# EAGLE design PayloadSheildV5 (EAGLE 6.2)
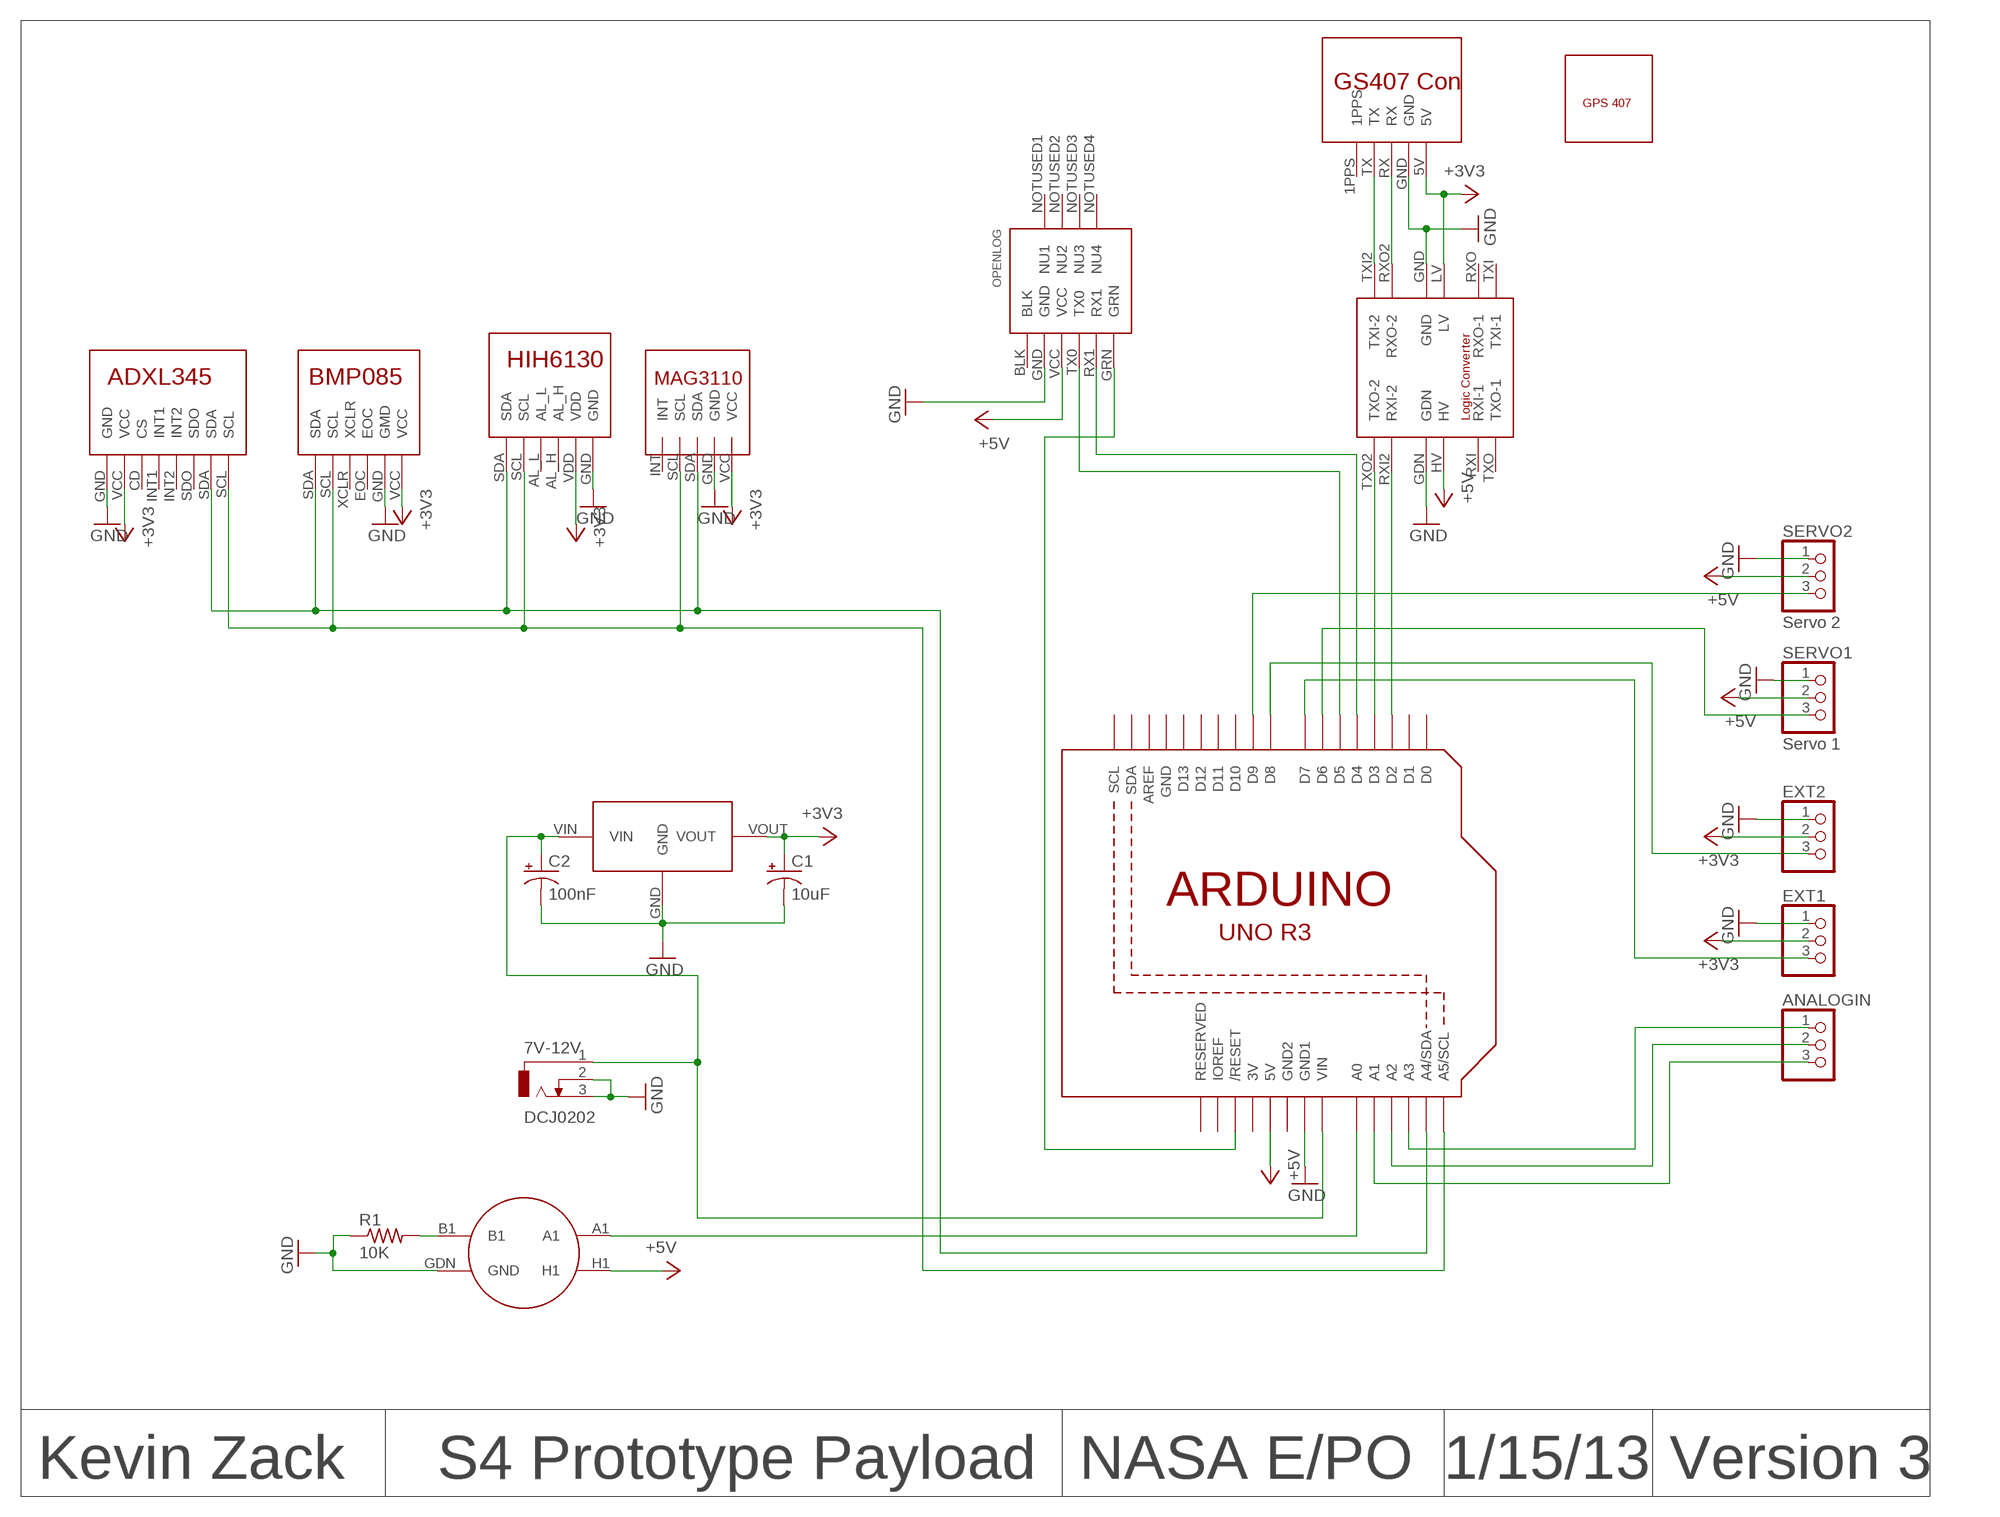
[diagram p0: schematic, sheet 1]

## Parts
3.3V  LD1117V33  [LD1117V33]
7V-12V  DCJ0202  [DCJ0202]
ADXL345  ADXL345  [ADXL345+]
ANALOGIN  PINHD-1X3  [1X03]
BMP085  BMP085  [BMP085]
C1  10uF  CPOL-USE2.5-6  [E2,5-6]
C2  100nF  CPOL-USE2.5-6  [E2,5-6]
EXT1  PINHD-1X3  [1X03]
EXT2  PINHD-1X3  [1X03]
GASSEN  GAS  [GAS]
GPS  GPS  [GPS]
GPSCON  EM407CONNECTOR  [EM407CONNECTOR]
HIH6310  HIH6130  [HIH6130]
LOGIC  LOGICCONVERTER  [LOGICCONVERTER]
MAG3110  MAG3110  [MAG3110]
OPENLOG  OPENLOG  [OPENLOG]
R1  10K  R-US_0204/5  [0204/5]
SERVO1  Servo 1  PINHD-1X3  [1X03]
SERVO2  Servo 2  PINHD-1X3  [1X03]
U2  ARDUINOR3  [ARDUINOR3]

## Nets
+3V3: 3.3V.VOUT ADXL345.VCC BMP085.VCC C1.+ EXT1.2 EXT2.2 GPSCON.5V HIH6310.VDD LOGIC.LV MAG3110.VCC
+5V: GASSEN.H1 LOGIC.HV OPENLOG.VCC SERVO1.2 SERVO2.2 U2.5V
GND: 3.3V.GND 7V-12V.2 7V-12V.3 ADXL345.GND BMP085.GND(GMD) C1.- C2.- EXT1.1 EXT2.1 GASSEN.GDN(GND) GPSCON.GND HIH6310.GND LOGIC.GDN LOGIC.GND MAG3110.GND OPENLOG.GND R1.1 SERVO1.1 SERVO2.1 U2.GND1
N$1: GASSEN.A1 U2.A0
N$2: GPSCON.RX LOGIC.RXO2(RXO-2)
N$3: OPENLOG.GRN U2.RESET(/RESET)
N$4: GASSEN.B1 R1.2
N$5: OPENLOG.RX1 U2.D4
N$6: OPENLOG.TX0 U2.D5
N$7: SERVO2.3 U2.D9
N$10: ANALOGIN.1 U2.A3
N$11: SERVO1.3 U2.D6
N$12: ANALOGIN.2 U2.A2
N$27: ANALOGIN.3 U2.A1
N$28: 3.3V.VIN 7V-12V.1 C2.+ U2.VIN
N$32: GPSCON.TX LOGIC.TXI2(TXI-2)
N$35: LOGIC.RXI2(RXI-2) U2.D2
N$36: EXT1.3 U2.D7
N$40: EXT2.3 U2.D8
N$41: LOGIC.TXO2(TXO-2) U2.D3
SCL: ADXL345.SCL BMP085.SCL HIH6310.SCL MAG3110.SCL U2.A5(A5/SCL)
SDA: ADXL345.SDA BMP085.SDA HIH6310.SDA MAG3110.SDA U2.A4(A4/SDA)
Unconnected: ADXL345.CD(CS) ADXL345.INT1 ADXL345.INT2 ADXL345.SDO BMP085.EOC BMP085.XCLR GPSCON.1PPS HIH6310.AL_H HIH6310.AL_L LOGIC.RXI(RXI-1) LOGIC.RXO(RXO-1) LOGIC.TXI(TXI-1) LOGIC.TXO(TXO-1) MAG3110.INT OPENLOG.BLK OPENLOG.NOTUSED1(NU1) OPENLOG.NOTUSED2(NU2) OPENLOG.NOTUSED3(NU3) OPENLOG.NOTUSED4(NU4) U2.AREF U2.D0 U2.D1 U2.D10 U2.D11 U2.D12 U2.D13 U2.IOREF U2.RESERVED U2.SCL U2.SDA

## Notes on the sheet
- Kevin Zack | S4 Prototype Payload | NASA E/PO | 1/15/13 | Version 3

## Power pins joined to a net without a drawn wire
3V: U2.3V
GND: U2.GND
GND2: U2.GND2

## Library data of the parts
3.3V = NASAEPO:LD1117V33
7V-12V = con-jack:DCJ0202: DC POWER JACK Source: DCJ0202.pdf; OC_FARNELL: unknown; OC_NEWARK: unknown
ADXL345 = NASAEPO:ADXL345
ANALOGIN EXT1 EXT2 SERVO1 SERVO2 = adafruit:PINHD-1X3: PIN HEADER
BMP085 = NASAEPO:BMP085
C1 C2 = rcl:CPOL-US: POLARIZED CAPACITOR, American symbol
GASSEN = NASAEPO:GAS
GPS = NASAEPO:GPS
GPSCON = NASAEPO:EM407CONNECTOR
HIH6310 = NASAEPO:HIH6130
LOGIC = NASAEPO:LOGICCONVERTER
MAG3110 = NASAEPO:MAG3110
OPENLOG = NASAEPO:OPENLOG
R1 = rcl:R-US_: RESISTOR, American symbol
U2 = NASAEPO:ARDUINOR3: This is a new object for the new Arduino R3 - with extra pins that you may want to use (such as IOref, and duplicated A4/A5

## Board
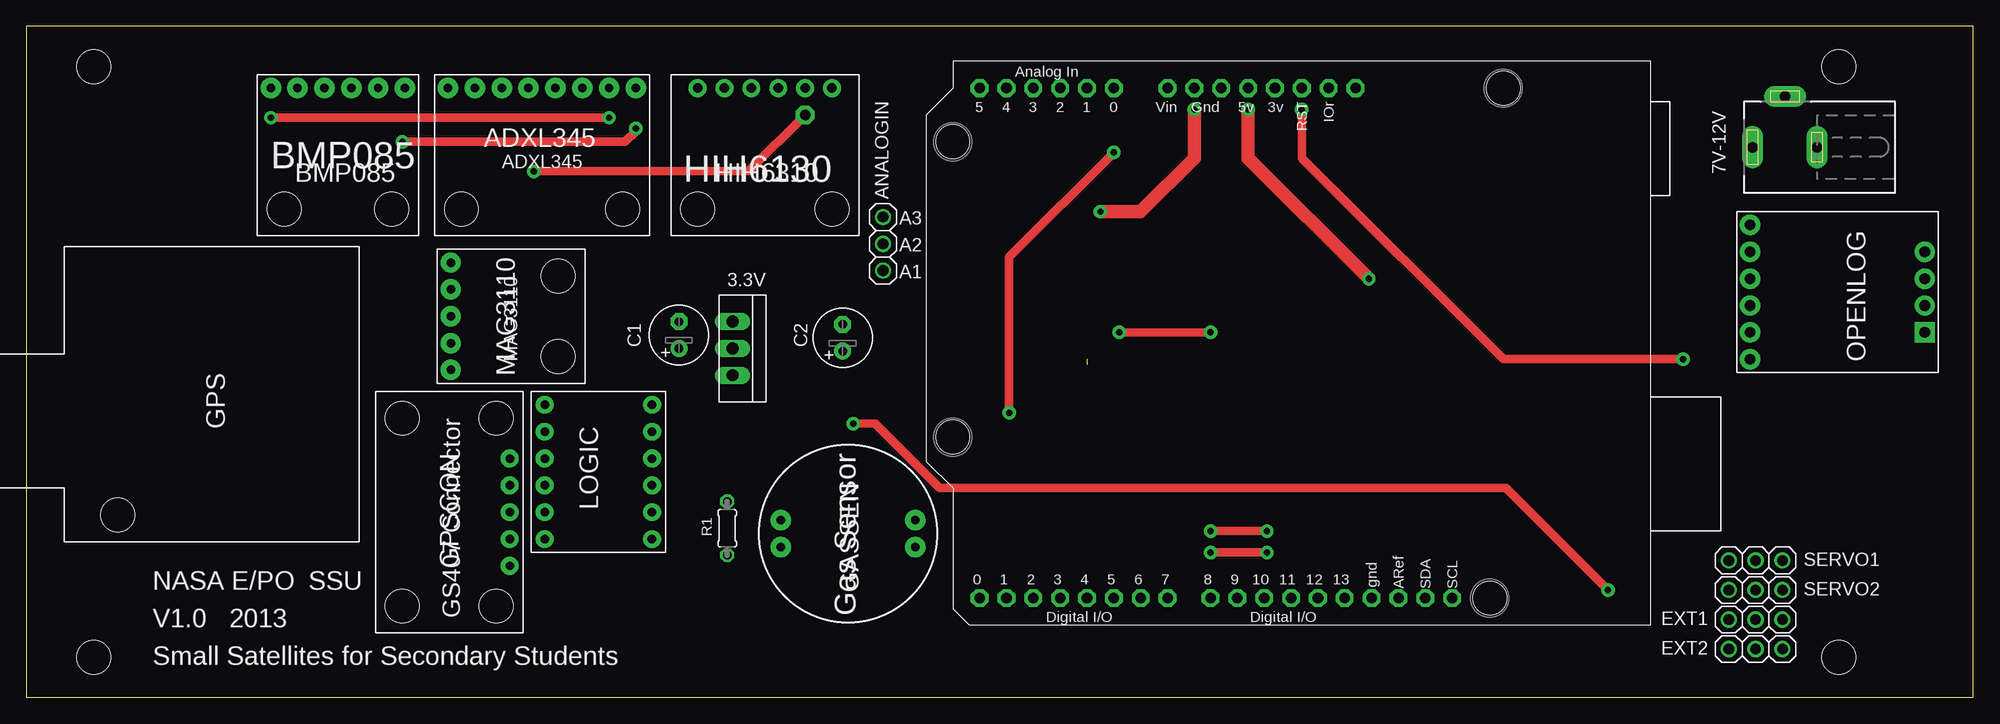
[diagram p1: board, top side]
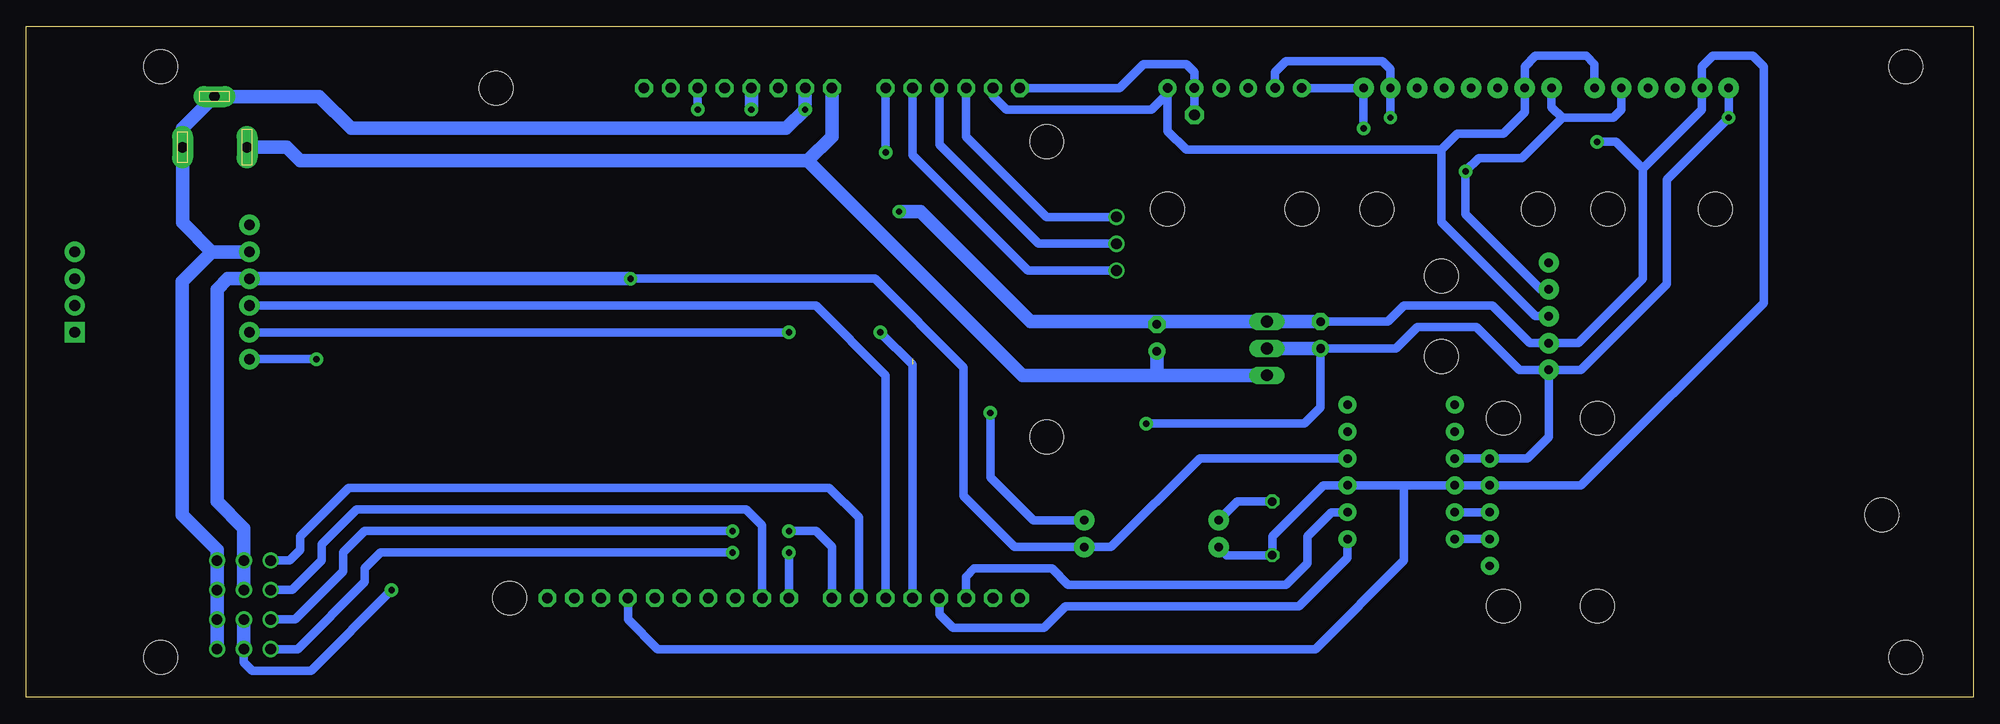
[diagram p2: board, bottom side, seen from below]

Size 184.15 x 63.5 mm. Coordinates in mm from the lower left corner, seen from the top.
Outline: 0,0 184.15,0 184.15,63.5 0,63.5 0,0
Copper layers (1*16): Top 0.035559375mm / dielectric 1.501140625mm / Bottom 0.035559375mm
Design rules: minimum track width 10mil, minimum drill 15mil, track to track 6mil, track to pad 6mil, pad to pad 6mil, via to via 6mil, smd to smd 6mil, copper to edge 15mil, drill to drill 8mil, minimum pad ring 10mil, minimum via ring 8mil, stop-mask expansion 4mil, vias tented up to drill 0mil, thermal gap 10mil
Holes 3.2 mm at 6.35,3.81 6.35,59.69 171.45,59.69 171.45,3.81

### Footprints (pad centres in the part's own frame; a part is rotated, then mirrored left to right if it is on the bottom)
LD1117V33 = drill 1.118 long: GND 2.54,1.27; VIN 7.62,1.27; VOUT 5.08,1.27
DCJ0202 = drill 1 pad 2 long: 1 0,3.1; 2 4.8,0; 3 0,-3
ADXL345+ = drill 0.8 pad 1.93: CD 6.35,1.27; GND 1.27,1.27; INT1 8.89,1.27; INT2 11.43,1.27; SCL 19.05,1.27; SDA 16.51,1.27; SDO 13.97,1.27; VCC 3.81,1.27 | hole 3.2: 2.54,12.7; 17.78,12.7
1X03 = drill 1.016: 1 -2.54,0; 2 0,0; 3 2.54,0
BMP085 = drill 0.8 pad 1.93: EOC 6.35,13.97; GND 3.81,13.97; SCL 11.43,13.97; SDA 13.97,13.97; VCC 1.27,13.97; XCLR 8.89,13.97 | hole 3.2: 2.54,2.54; 12.7,2.54
E2,5-6 = drill 0.813 pad 1.6: + -1.27,0 | drill 0.813 pad 1.6 octagon: - 1.27,0
GAS = drill 0.8 pad 1.93: A1 7.62,15.24; B1 7.62,2.54; GDN 10.16,2.54; H1 10.16,15.24
GPS = hole 3.2: 2.54,22.86
EM407CONNECTOR = drill 0.8 pad 1.676: 1PPS 16.51,12.7; 5V 6.35,12.7; GND 8.89,12.7; RX 11.43,12.7; TX 13.97,12.7 | hole 3.2: 2.54,11.43; 20.32,11.43; 20.32,2.54; 2.54,2.54
HIH6130 = drill 0.9 pad 1.676: AL_H 10.16,1.27; AL_L 7.62,1.27; GND 15.24,1.27; SCL 5.08,1.27; SDA 2.54,1.27; VDD 12.7,1.27 | hole 3.2: 2.54,12.7; 15.24,12.7
LOGICCONVERTER = drill 0.8 pad 1.676: GDN 11.43,6.35; GND 1.27,6.35; HV 11.43,8.89; LV 1.27,8.89; RXI 11.43,11.43; RXI2 11.43,3.81; RXO 1.27,11.43; RXO2 1.27,3.81; TXI 1.27,13.97; TXI2 1.27,1.27; TXO 11.43,13.97; TXO2 11.43,1.27
MAG3110 = drill 0.8 pad 1.93: GND 8.89,1.27; INT 1.27,1.27; SCL 3.81,1.27; SDA 6.35,1.27; VCC 11.43,1.27 | hole 3.2: 2.54,11.43; 10.16,11.43
OPENLOG = drill 1 pad 1.93: BLK 17.78,1.27; GND 17.78,3.81; GRN 17.78,13.97; NOTUSED2 1.27,8.89; NOTUSED3 1.27,6.35; NOTUSED4 1.27,3.81; RX1 17.78,11.43; TX0 17.78,8.89; VCC 17.78,6.35 | drill 1 pad 1.93 square: NOTUSED1 1.27,11.43
0204/5 = drill 0.813 octagon: 1 -2.54,0; 2 2.54,0
ARDUINOR3 = drill 1 pad 1.676 octagon: 3V 35.56,2.54; 5V 38.1,2.54; A0 50.8,2.54; A1 53.34,2.54; A2 55.88,2.54; A3 58.42,2.54; A4 60.96,2.54; A5 63.5,2.54; AREF 23.876,50.8; D0 63.5,50.8; D1 60.96,50.8; D2 58.42,50.8; D3 55.88,50.8; D4 53.34,50.8; D5 50.8,50.8; D6 48.26,50.8; D7 45.72,50.8; D8 41.656,50.8; D9 39.116,50.8; D10 36.576,50.8; D11 34.036,50.8; D12 31.496,50.8; D13 28.956,50.8; GND 26.416,50.8; GND1 43.18,2.54; GND2 40.64,2.54; IOREF 30.48,2.54; RESERVED 27.94,2.54; RESET 33.02,2.54; SCL 18.796,50.8; SDA 21.336,50.8; VIN 45.72,2.54 | hole 3.2: 13.97,2.54; 66.04,7.62; 15.24,50.8; 66.04,35.56

### Placement (x,y rotation side)
3.3V  65.53,38.1 270 top
7V-12V  166.37,52.07 90 top
ADXL345  58.93,58.93 180 top
ANALOGIN  81.03,42.93 270 top
BMP085  21.84,43.69 0 top
C1  61.72,34.29 90 top
C2  77.22,34.04 90 top
EXT1  163.58,7.37 180 top
EXT2  163.58,4.57 180 top
GASSEN  68.83,24.38 270 top
GPS  31.5,14.73 90 top
GPSCON  33.02,28.96 270 top
HIH6310  78.74,58.93 180 top
LOGIC  47.75,13.72 0 top
MAG3110  38.86,42.42 270 top
OPENLOG  180.85,45.97 180 top
R1  66.29,16 90 top
SERVO1  163.58,12.95 180 top
SERVO2  163.58,10.16 180 top
U2  153.67,60.2 180 top

### Tracks (layer width: path | path; a pad name or v marks a point on that pad's centre or on a via)
+3V3  (via drill 0.6 pad 1.27)
  Top 0.813: v149.61,10.16 139.95,19.81 86.36,19.81 80.26,25.91 v78.23,25.91 | v55.12,54.86 v23.11,54.86
  Bottom 0.813: EXT2.2 163.58,3.3 162.81,2.54 157.23,2.54 v149.61,10.16 | v78.23,25.91 63.25,25.91 61.72,27.43 C1.+ 54.61,33.02 52.58,35.05 46.99,35.05 42.93,30.99 MAG3110.VCC | HIH6310.VDD 66.04,59.18 65.02,60.2 55.88,60.2 55.12,59.44 ADXL345.VCC v55.12,54.86 | MAG3110.VCC 37.08,30.99 28.96,39.12 28.96,49.02 v23.11,54.86 BMP085.VCC | LOGIC.LV GPSCON.5V 42.16,22.61 40.13,24.64 MAG3110.VCC
  Bottom 1.27: EXT1.2 EXT2.2 | 3.3V.VOUT C1.+
+5V  (via drill 0.6 pad 1.27)
  Top 1.27: v115.57,55.63 115.57,51.05 v127,39.62
  Bottom 0.813: v127,39.62 103.89,39.62 95.5,31.24 95.5,19.05 90.68,14.22 GASSEN.H1 81.53,14.22 73.15,22.61 LOGIC.HV
  Bottom 1.27: U2.5V v115.57,55.63 | v127,39.62 OPENLOG.VCC 165.1,39.62 166.12,38.61 166.12,18.54 163.58,16 SERVO1.2 SERVO2.2
GND  (via drill 0.6 pad 1.27)
  Top 0.813: v57.66,53.85 57.66,53.59 56.64,52.58 v35.56,52.58
  Top 1.27: v110.49,55.63 110.49,51.05 105.41,45.97 v101.6,45.97
  Bottom 0.813: GASSEN.GDN 70.61,13.46 R1.1 66.29,15.24 61.47,20.07 LOGIC.GDN 53.85,20.07 | HIH6310.GND ADXL345.GND v57.66,53.85 | 31.24,50.04 25.65,55.63 BMP085.GND 25.65,59.69 24.64,60.71 20.83,60.71 19.81,59.69 19.81,37.34 37.08,20.07 GPSCON.GND LOGIC.GND 53.85,20.07 | 31.24,50.04 31.24,39.62 37.34,33.53 MAG3110.GND 41.91,33.53 45.47,37.08 53.85,37.08 55.37,35.56 C1.- | U2.GND 127.25,7.37 124.46,4.57 62.23,4.57 53.85,12.95 53.85,20.07 | v35.56,52.58 33.78,52.58 31.24,50.04
  Bottom 1.27: U2.GND1 v110.49,55.63 112.27,53.85 153.42,53.85 156.44,56.87 7V-12V.2 169.37,53.87 7V-12V.3 169.37,44.91 166.62,42.16 | 166.62,42.16 OPENLOG.GND | 166.62,42.16 169.42,39.37 169.42,17.27 166.12,13.97 SERVO1.1 SERVO2.1 EXT1.1 EXT2.1 | 77.47,35.56 89.15,35.56 99.57,45.97 v101.6,45.97 | 77.47,35.56 3.3V.GND C1.- | C2.- 77.47,35.56
N$1  (via drill 0.6 pad 1.27)
  Top 0.813: v102.87,51.56 92.96,41.66 v92.96,26.92
  Bottom 0.813: GASSEN.A1 88.9,16.76 92.96,20.83 v92.96,26.92 | U2.A0 v102.87,51.56
N$2
  Bottom 0.813: GPSCON.RX LOGIC.RXO2
N$3  (via drill 0.6 pad 1.27)
  Top 0.813: v120.65,55.63 120.65,51.05 139.7,32 v156.72,32
  Bottom 0.813: U2.RESET v120.65,55.63 | v156.72,32 OPENLOG.GRN
N$4
  Bottom 0.813: GASSEN.B1 69.6,18.54 R1.2
N$5  (via drill 0.6 pad 1.27)  (1 unrouted)
  Top 0.813: v112.01,34.54 v103.38,34.54
  Bottom 0.813: OPENLOG.RX1 v112.01,34.54 | U2.D4 100.33,31.5 v103.38,34.54
N$6
  Bottom 0.813: OPENLOG.TX0 109.47,37.08 102.87,30.48 U2.D5
N$7
  Bottom 0.813: SERVO2.3 159,10.16 156.21,12.95 156.21,14.48 152.91,17.78 116.08,17.78 114.55,16.26 U2.D9
N$10
  Bottom 0.813: U2.A3 95.25,53.09 87.63,45.47 ANALOGIN.1
N$11
  Bottom 0.813: U2.D6 105.41,17.02 108.2,19.81 153.67,19.81 158.24,15.24 158.24,13.97 159.26,12.95 SERVO1.3
N$12
  Bottom 0.813: ANALOGIN.2 88.39,42.93 97.79,52.32 U2.A2
N$27
  Bottom 0.813: ANALOGIN.3 89.41,40.39 100.33,51.31 U2.A1
N$28
  Bottom 1.27: U2.VIN 107.95,53.09 110.24,50.8 | 110.24,50.8 158.24,50.8 159.51,52.07 7V-12V.1 | 3.3V.VIN 77.22,30.48 | 77.22,30.48 89.92,30.48 110.24,50.8 | C2.+ 77.22,30.48
N$32
  Bottom 0.813: GPSCON.TX LOGIC.TXI2
N$35
  Bottom 0.813: U2.D2 95.25,11.43 94.49,12.19 87.12,12.19 85.6,10.67 65.02,10.67 62.99,12.7 62.99,15.24 60.71,17.53 LOGIC.RXI2
N$36  (via drill 0.6 pad 1.27)
  Top 0.813: v117.35,15.75 v112.01,15.75
  Bottom 0.813: EXT1.3 158.75,7.37 154.18,11.94 154.18,13.72 152.15,15.75 v117.35,15.75 | v112.01,15.75 109.47,15.75 107.95,14.22 U2.D7
N$40  (via drill 0.6 pad 1.27)
  Top 0.813: v117.35,13.72 v112.01,13.72
  Bottom 0.813: EXT2.3 158.5,4.57 152.15,10.92 152.15,12.19 150.62,13.72 v117.35,13.72 | v112.01,13.72 U2.D8
N$41
  Bottom 0.813: U2.D3 97.79,7.87 96.52,6.6 87.88,6.6 85.85,8.64 63.75,8.64 59.18,13.21 LOGIC.TXO2
SCL  (via drill 0.6 pad 1.27, 1 pad 1.78)
  Top 0.813: v73.66,55.12 68.33,49.78 v48.01,49.78
  Bottom 0.813: U2.A5 80.77,57.66 78.49,59.94 74.42,59.94 73.66,59.18 HIH6310.SCL v73.66,55.12 | ADXL345.SCL 39.88,55.88 38.86,54.86 | 38.86,54.86 34.04,54.86 33.27,55.63 BMP085.SCL | MAG3110.SCL 40.89,38.61 48.01,45.72 v48.01,49.78 46.74,51.05 42.67,51.05 38.86,54.86
SDA
  Bottom 0.813: 76.2,57.15 HIH6310.SDA | U2.A4 92.71,56.9 91.44,55.63 77.72,55.63 76.2,57.15 | BMP085.SDA 35.81,59.94 36.58,60.71 41.4,60.71 42.42,59.69 ADXL345.SDA 42.42,55.37 44.45,53.34 48.77,53.34 50.29,51.82 | MAG3110.SDA 41.4,36.07 50.29,44.96 50.29,51.82 | 50.29,51.82 74.42,51.82 76.2,53.59 76.2,57.15

### Text on the board
tNames: A3 | A2 | A1 | NASA E/PO | SSU | V1.0 2013 | Small Satellites for Secondary Students